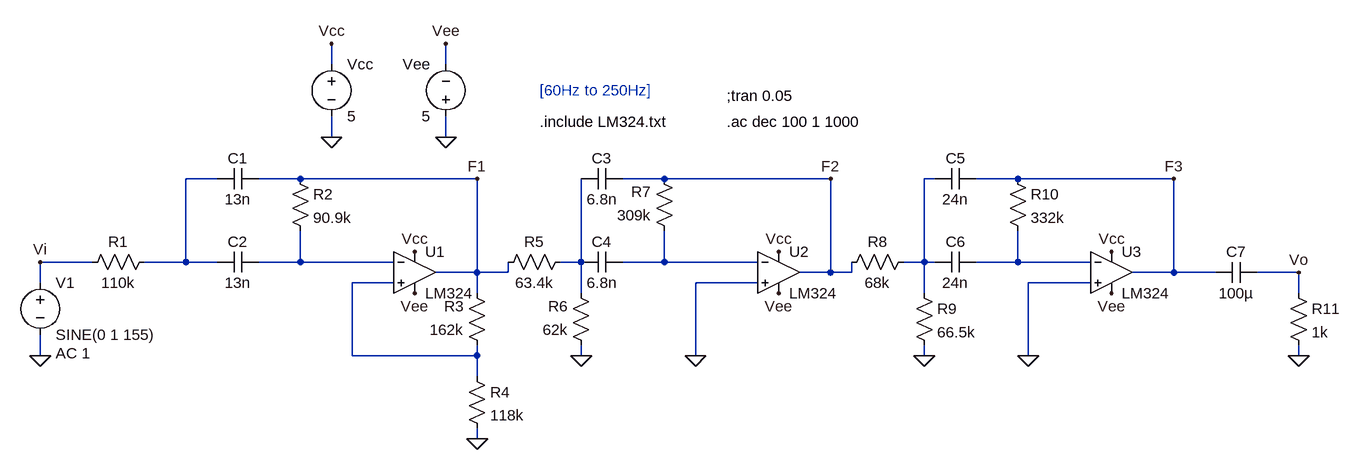
[diagram p0: schematic FinalBassFilter.asc]
FinalBassFilter.asc, the LTspice schematic file:
Version 4
SHEET 1 1524 680
WIRE -32 -160 -32 -192
WIRE 144 -160 144 -192
WIRE -32 -48 -32 -80
WIRE 144 -48 144 -80
WIRE -208 16 -256 16
WIRE -80 16 -144 16
WIRE 192 16 -80 16
WIRE 480 16 416 16
WIRE 736 16 480 16
WIRE 896 16 880 16
WIRE 1024 16 960 16
WIRE 1264 16 1024 16
WIRE -400 144 -480 144
WIRE -256 144 -256 16
WIRE -256 144 -320 144
WIRE -208 144 -256 144
WIRE -80 144 -80 96
WIRE -80 144 -144 144
WIRE 64 144 -80 144
WIRE 352 144 352 16
WIRE 352 144 320 144
WIRE 480 144 480 96
WIRE 480 144 416 144
WIRE 624 144 480 144
WIRE 880 144 880 16
WIRE 880 144 848 144
WIRE 896 144 880 144
WIRE 1024 144 1024 96
WIRE 1024 144 960 144
WIRE 1136 144 1024 144
WIRE 192 160 192 16
WIRE 192 160 128 160
WIRE 240 160 240 144
WIRE 240 160 192 160
WIRE 736 160 736 16
WIRE 736 160 688 160
WIRE 768 160 768 144
WIRE 768 160 736 160
WIRE 1264 160 1264 16
WIRE 1264 160 1200 160
WIRE 1328 160 1264 160
WIRE 1456 160 1392 160
WIRE -480 176 -480 144
WIRE 64 176 0 176
WIRE 624 176 528 176
WIRE 1136 176 1040 176
WIRE 192 192 192 160
WIRE 352 192 352 144
WIRE 880 192 880 144
WIRE 1456 192 1456 160
WIRE -480 288 -480 256
WIRE 0 288 0 176
WIRE 192 288 192 272
WIRE 192 288 0 288
WIRE 352 288 352 272
WIRE 528 288 528 176
WIRE 880 288 880 272
WIRE 1040 288 1040 176
WIRE 1456 288 1456 272
WIRE 192 320 192 288
WIRE 192 416 192 400
FLAG 528 288 0
FLAG -480 288 0
FLAG 192 16 F1
FLAG 736 16 F2
FLAG -480 144 Vi
FLAG 1040 288 0
FLAG 1264 16 F3
FLAG 880 288 0
FLAG 352 288 0
FLAG 192 416 0
FLAG 96 192 Vee
FLAG 96 128 Vcc
FLAG 656 192 Vee
FLAG 656 128 Vcc
FLAG 1168 192 Vee
FLAG 1168 128 Vcc
FLAG -32 -192 Vcc
FLAG -32 -48 0
FLAG 144 -48 0
FLAG 144 -192 Vee
FLAG 1456 288 0
FLAG 1456 160 Vo
SYMBOL res -304 128 R90
WINDOW 0 0 56 VBottom 2
WINDOW 3 32 56 VTop 2
SYMATTR InstName R1
SYMATTR Value 110k
SYMBOL voltage -480 160 R0
WINDOW 123 24 124 Left 2
WINDOW 39 0 0 Left 0
SYMATTR Value2 AC 1
SYMATTR InstName V1
SYMATTR Value SINE(0 1 155)
SYMBOL res 176 304 R0
SYMATTR InstName R4
SYMATTR Value 118k
SYMBOL res -96 0 R0
SYMATTR InstName R2
SYMATTR Value 90.9k
SYMBOL res 336 128 R90
WINDOW 0 0 56 VBottom 2
WINDOW 3 32 56 VTop 2
SYMATTR InstName R5
SYMATTR Value 63.4k
SYMBOL res 368 288 R180
WINDOW 0 36 76 Left 2
WINDOW 3 36 40 Left 2
SYMATTR InstName R6
SYMATTR Value 62k
SYMBOL res 496 112 R180
WINDOW 0 36 76 Left 2
WINDOW 3 36 40 Left 2
SYMATTR InstName R7
SYMATTR Value 309k
SYMBOL res 752 160 R270
WINDOW 0 32 56 VTop 2
WINDOW 3 0 56 VBottom 2
SYMATTR InstName R8
SYMATTR Value 68k
SYMBOL res 864 176 R0
SYMATTR InstName R9
SYMATTR Value 66.5k
SYMBOL res 1008 0 R0
SYMATTR InstName R10
SYMATTR Value 332k
SYMBOL cap -144 0 R90
WINDOW 0 0 32 VBottom 2
WINDOW 3 32 32 VTop 2
SYMATTR InstName C1
SYMATTR Value 13n
SYMBOL cap -144 128 R90
WINDOW 0 0 32 VBottom 2
WINDOW 3 32 32 VTop 2
SYMATTR InstName C2
SYMATTR Value 13n
SYMBOL cap 416 0 R90
WINDOW 0 0 32 VBottom 2
WINDOW 3 32 32 VTop 2
SYMATTR InstName C3
SYMATTR Value 6.8n
SYMBOL cap 416 128 R90
WINDOW 0 0 32 VBottom 2
WINDOW 3 32 32 VTop 2
SYMATTR InstName C4
SYMATTR Value 6.8n
SYMBOL cap 960 0 R90
WINDOW 0 0 32 VBottom 2
WINDOW 3 32 32 VTop 2
SYMATTR InstName C5
SYMATTR Value 24n
SYMBOL cap 960 128 R90
WINDOW 0 0 32 VBottom 2
WINDOW 3 32 32 VTop 2
SYMATTR InstName C6
SYMATTR Value 24n
SYMBOL res 208 288 R180
WINDOW 0 36 76 Left 2
WINDOW 3 36 40 Left 2
SYMATTR InstName R3
SYMATTR Value 162k
SYMBOL OpAmps\\opamp2 96 96 R0
SYMATTR InstName U1
SYMATTR Value LM324
SYMBOL OpAmps\\opamp2 656 96 R0
SYMATTR InstName U2
SYMATTR Value LM324
SYMBOL OpAmps\\opamp2 1168 96 R0
SYMATTR InstName U3
SYMATTR Value LM324
SYMBOL voltage -32 -176 R0
WINDOW 123 0 0 Left 0
WINDOW 39 0 0 Left 0
SYMATTR InstName Vcc
SYMATTR Value 5
SYMBOL voltage 144 -64 R180
WINDOW 0 24 96 Left 2
WINDOW 3 24 16 Left 2
WINDOW 123 0 0 Left 0
WINDOW 39 0 0 Left 0
SYMATTR InstName Vee
SYMATTR Value 5
SYMBOL cap 1392 144 R90
WINDOW 0 0 32 VBottom 2
WINDOW 3 32 32 VTop 2
SYMATTR InstName C7
SYMATTR Value 100µ
SYMBOL res 1440 176 R0
SYMATTR InstName R11
SYMATTR Value 1k
TEXT 576 -112 Left 2 !;tran 0.05
TEXT 576 -72 Left 2 !.ac dec 100 1 1000
TEXT 288 -72 Left 2 !.include LM324.txt
TEXT 288 -120 Left 2 ;[60Hz to 250Hz]

The netlist it stands for:
* FinalBassFilter.asc
R1 N001 Vi 110k
V1 Vi 0 SINE(0 1 155) AC 1
R4 N007 0 118k
R2 F1 N003 90.9k
R5 N004 F1 63.4k
R6 0 N004 62k
R7 N005 F2 309k
R8 F2 N002 68k
R9 N002 0 66.5k
R10 F3 N006 332k
C1 F1 N001 13n
C2 N003 N001 13n
C3 F2 N004 6.8n
C4 N005 N004 6.8n
C5 F3 N002 24n
C6 N006 N002 24n
R3 N007 F1 162k
XU1 N007 N003 Vcc Vee F1 LM324  ; pins In+ In- V+ V- OUT
XU2 0 N005 Vcc Vee F2 LM324  ; pins In+ In- V+ V- OUT
XU3 0 N006 Vcc Vee F3 LM324  ; pins In+ In- V+ V- OUT
Vcc Vcc 0 5
Vee 0 Vee 5
C7 Vo F3 100µ
R11 Vo 0 1k
;tran 0.05
.ac dec 100 1 1000
.include LM324.txt
* [60Hz to 250Hz]
.backanno
.end